# Altium schematic sheet solid_state_overdrive.SchDoc
size A4
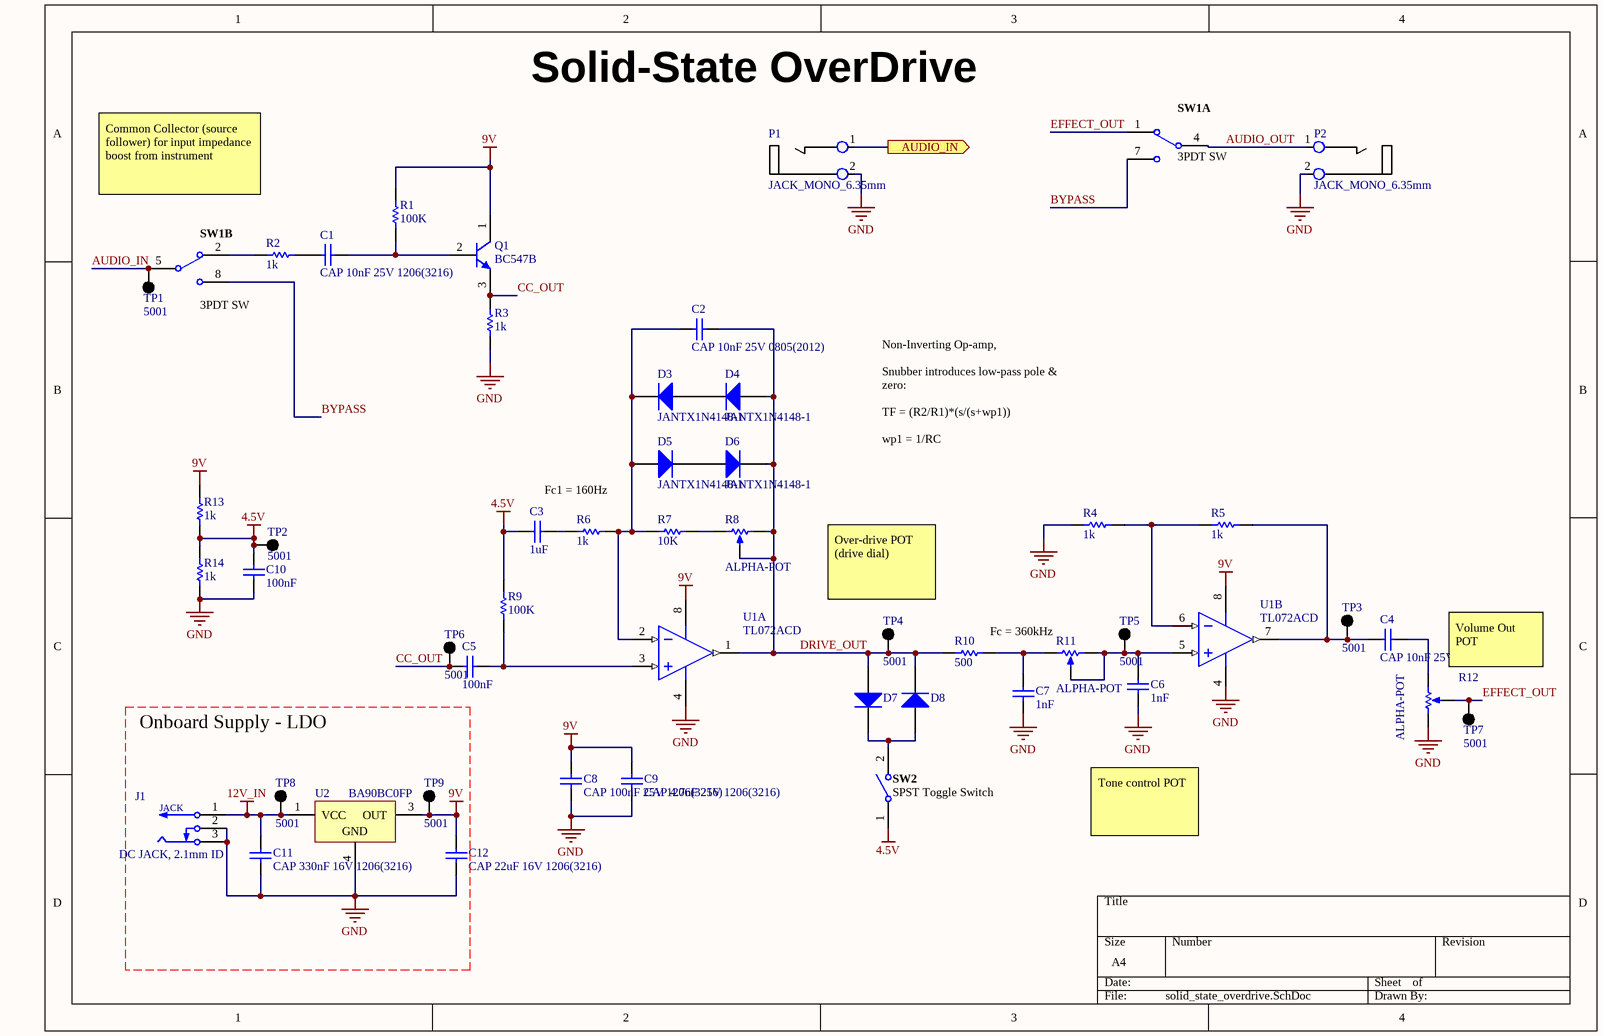
[diagram p0: solid_state_overdrive.SchDoc]

## Parts
C1  CAP 10nF 25V 1206(3216)  [CAPC1206(3216)170_N]
C2  CAP 10nF 25V 0805(2012)  [CAPC0805(2012)75_L]
C3  value 1uF  [CAPC0805(2012)145_L]  (hidden comment: CAP 1uF 50V 0805(2012))
C4  CAP 10nF 25V 1206(3216)  [CAPC1206(3216)170_N]
C5  value 100nF  [CAPC0805(2012)145_N]  (hidden comment: CAP 100nF 50V 0805(2012))
C6  value 1nF  [CAPC0805(2012)75_M]  (hidden comment: CAP 1nF 50V 0805(2012))
C7  value 1nF  [CAPC0805(2012)75_M]  (hidden comment: CAP 1nF 50V 0805(2012))
C8  CAP 100nF 25V 1206(3216)  [CAPC1206(3216)190_L]
C9  CAP 4.7nF 25V 1206(3216)  [CAPC1206(3216)100_N]
C10  value 100nF  [CAPC0805(2012)145_N]  (hidden comment: CAP 100nF 50V 0805(2012))
C11  CAP 330nF 16V 1206(3216)  [CAPC1206(3216)110_N]
C12  CAP 22uF 16V 1206(3216)  [CAPC1206(3216)190_M]
D3  JANTX1N4148-1  [MCSM-DO-35-2]
D4  JANTX1N4148-1  [MCSM-DO-35-2]
D5  JANTX1N4148-1  [MCSM-DO-35-2]
D6  JANTX1N4148-1  [MCSM-DO-35-2]
D7  JANTX1N4148-1  [MCSM-DO-35-2]  (value not drawn)
D8  JANTX1N4148-1  [MCSM-DO-35-2]  (value not drawn)
J1  DC JACK, 2.1mm ID  [163-179PH-EX]
P1  JACK_MONO_6.35mm  [MONO_JUMPER]
P2  JACK_MONO_6.35mm  [MONO_JUMPER]
Q1  BC547B  [ONSC-TO-92-3-29-11]
R1  value 100K  [RESC0805(2012)_L]  (hidden comment: 100K 5% 0805(2012))
R2  value 1k  [RESC0805(2012)_N]  (hidden comment: 1K 5% 0805(2012))
R3  value 1k  [RESC0805(2012)_N]  (hidden comment: 1K 5% 0805(2012))
R4  value 1k  [RESC0805(2012)_N]  (hidden comment: 1K 5% 0805(2012))
R5  value 1k  [RESC0805(2012)_N]  (hidden comment: 1K 5% 0805(2012))
R6  value 1k  [RESC0805(2012)_N]  (hidden comment: 1K 5% 0805(2012))
R7  value 10K  [RESC0805(2012)_L]  (hidden comment: 10K 5% 0805(2012))
R8  ALPHA-POT  [ALPHA_POT]
R9  value 100K  [RESC0805(2012)_L]  (hidden comment: 100K 5% 0805(2012))
R10  value 500  [RESC0805(2012)_L]  (hidden comment: 510R 5% 0805(2012))
R11  ALPHA-POT  [ALPHA_POT]
R12  ALPHA-POT  [ALPHA_POT]
R13  value 1k  [RESC0805(2012)_N]  (hidden comment: 1K 5% 0805(2012))
R14  value 1k  [RESC0805(2012)_N]  (hidden comment: 1K 5% 0805(2012))
SW1  3PDT SW  [3PDT]  (parts A,B of 3)
SW2  SPST Toggle Switch  [TOGGLE_SW_JUMPER]
TP1  5001  [KSTN-5001]
TP2  5001  [KSTN-5001]
TP3  5001  [KSTN-5001]
TP4  5001  [KSTN-5001]
TP5  5001  [KSTN-5001]
TP6  5001  [KSTN-5001]
TP7  5001  [KSTN-5001]
TP8  5001  [KSTN-5001]
TP9  5001  [KSTN-5001]
U1  TL072ACD  [D0008A_M]  (parts A,B of 2)
U2  BA90BC0FP  [BA90BC0FP-E2]

## Ports
AUDIO_IN (out)

## Nets
4.5V: C3.2 C10.2 R9.2 R13.2 R14.1 SW2.1 TP2.1
9V: C8.2 C9.2 C12.2 Q1.1(C) R1.2 R13.1 TP9.1 U1.8(VCC+) U2.3(OUT)
12V_IN: C11.2 J1.1 TP8.1 U2.1(VCC)
GND: C6.2 C7.2 C8.1 C9.1 C10.1 C11.1 C12.1 J1.2 J1.3 P1.2 P2.2 R3.1 R4.2 R12.3(CW) R14.2 U1.4(VCC-) U2.4(GND)
AUDIO_IN: P1.1 ; port AUDIO_IN
AUDIO_IN: SW1.5 TP1.1  [a separate net that carries the same name]
AUDIO_OUT: P2.1 SW1.4
BYPASS: SW1.7 SW1.8
CC_OUT: C5.1 Q1.3(E) R3.2 TP6.1
DRIVE_OUT: C2.2 D4.1(A) D6.2(K) D7.1(A) D8.2(K) R8.1(CCW) R8.2(WIPER) R10.2 TP4.1 U1.1(OUT1)
EFFECT_OUT: R12.2(WIPER) SW1.1 TP7.1
NetC1_1: C1.1 R2.1
NetC1_2: C1.2 Q1.2(B) R1.1
NetC2_1: C2.1 D3.2(K) D5.1(A) R6.1 R7.2 U1.2(IN1-)
NetC3_1: C3.1 R6.2
NetC4_1: C4.1 R5.1 TP3.1 U1.7(OUT2)
NetC4_2: C4.2 R12.1(CCW)
NetC5_2: C5.2 R9.1 U1.3(IN1+)
NetC6_1: C6.1 R11.1(CCW) R11.2(WIPER) TP5.1 U1.5(IN2+)
NetC7_1: C7.1 R10.1 R11.3(CW)
NetD3_1: D3.1(A) D4.2(K)
NetD5_2: D5.2(K) D6.1(A)
NetD7_2: D7.2(K) D8.1(A) SW2.2
NetR2_2: R2.2 SW1.2
NetR4_1: R4.1 R5.2 U1.6(IN2-)
NetR7_1: R7.1 R8.3(CW)

## Notes on the sheet
- Solid-State OverDrive
- Common Collector (source follower) for input impedance boost from instrument
- Non-Inverting Op-amp,
  Snubber introduces low-pass pole & zero:
  TF = (R2/R1)*(s/(s+wp1))
  wp1 = 1/RC
- Fc1 = 160Hz
- Over-drive POT (drive dial)
- Fc = 360kHz
- (near R12) Volume Out POT
- Onboard Supply - LDO
- Tone control POT
- Labels drawn without touching a wire or pin: GND
- (in symbol DC JACK, 2.1mm ID) JACK

## Library data of the parts
C1 C4 = CMP-1037-03495-1: CAP 10nF 25V ±20% 1206 (3216 Metric) Thickness 1.7mm SMD; Case-EIA: 1206; Case-Metric: 3216; Tolerance: Â±20%; Rated Voltage: 25 V; Max Thickness: 1.7 mm; Technology: SMT; Value: 10nF
C2 = CMP-1036-03833-1: CAP 10nF 25V ±20% 0805 (2012 Metric) Thickness 0.75mm SMD; Case-EIA: 0805; Tolerance: Â±20%; Case-Metric: 2012; Max Thickness: 0.75 mm; Technology: SMT; Value: 10nF; Rated Voltage: 25 V
C3 = CMP-1036-04761-1: CAP 1uF 50V ±10% 0805 (2012 Metric) Thickness 1.45mm SMD; Tolerance: Â±10%; Case-EIA: 0805; Case-Metric: 2012; Technology: SMT; Max Thickness: 1.45 mm; Rated Voltage: 50 V
C5 C10 = CMP-1036-04417-1: CAP 100nF 50V ±5% 0805 (2012 Metric) Thickness 1.45mm SMD; Case-Metric: 2012; Tolerance: Â±5%; Case-EIA: 0805; Max Thickness: 1.45 mm; Rated Voltage: 50 V; Technology: SMT
C6 C7 = CMP-1036-02981-1: CAP 1nF 50V ±20% 0805 (2012 Metric) Thickness 0.75mm SMD; Case-Metric: 2012; Case-EIA: 0805; Tolerance: Â±20%; Rated Voltage: 50 V; Technology: SMT; Max Thickness: 0.75 mm
C8 = CMP-1037-04186-1: CAP 100nF 25V ±1% 1206 (3216 Metric) Thickness 1.9mm SMD; Case-Metric: 3216; Tolerance: Â±1%; Case-EIA: 1206; Technology: SMT; Max Thickness: 1.9 mm; Rated Voltage: 25 V; Value: 100nF
C9 = CMP-1037-03099-1: CAP 4.7nF 25V ±1% 1206 (3216 Metric) Thickness 1mm SMD; Case-Metric: 3216; Case-EIA: 1206; Tolerance: Â±1%; Max Thickness: 1 mm; Value: 4.7nF; Technology: SMT; Rated Voltage: 25 V
C11 = CMP-1037-04467-1: CAP 330nF 16V ±20% 1206 (3216 Metric) Thickness 1.05mm SMD; Case-Metric: 3216; Case-EIA: 1206; Tolerance: Â±20%; Value: 330nF; Rated Voltage: 16 V; Max Thickness: 1.05 mm; Technology: SMT
C12 = CMP-1037-04993-1: CAP 22uF 16V ±20% 1206 (3216 Metric) Thickness 1.9mm SMD; Tolerance: Â±20%; Case-Metric: 3216; Case-EIA: 1206; Value: 22uF; Rated Voltage: 16 V; Technology: SMT; Max Thickness: 1.9 mm
D3-D8 = CMP-2000-06494-1: Glass Axial Switching Diode, 200 mA, 100 V, 2-Pin DO-35, RoHS, Bulk; Manufacturer: Microsemi; Peak Average Forward Current: 0.2A; Peak Reverse Recovery Time: 5ns; Rad Hard: No; Configuration: Single; Peak Forward Voltage: 1.2@0.1AV; Peak Reverse Repetitive Voltage: 75V; Breakdown Voltage: 100V; Peak Reverse Current: 0.5uA; Operating Temperature: -65to200°C; Package Description: 2-Pin Axial Lead, Dia 1.665 mm, Body Length 4.065 mm; PartNumber: 1N4148-1; Type: SwitchingDiode; Package: 2DO-35; Output Current: 0.2A; Mounting: ThroughHole; Mounting Technology: ThroughHole; Packaging: Bulk; Datasheet Version: Rev. 1, 11/2012; Manufacturer URL: http://www.microsemi.com/; Package Reference: DO-35-2; Datasheet URL: http://www.microsemi.com/document-portal/doc_download/125211-lds-0281
J1 = DC JACK, 2.1mm ID: DC BARREL JACK, 2.1mm ID; URL: https://ca.mouser.com/productdetail/163-179ph-ex
Q1 = CMP-1048-01467-1: Amplifier Transistor, NPN Silicon, 3-Pin TO-92, Bulk Box; Manufacturer: On Semiconductor; IC Continuous (A): 0.1; fT Min (MHz): 150; DatasheetVersion: Rev. 7; ComponentLink1URL: http://www.onsemi.com/; Polarity: NPN; RoHS: FALSE; ComponentLink1Description: Manufacturer URL; Packing: Bulk Box; PackageDescription: 3-Pin Transistor Outline, Body 4.825 x 3.685 mm, Pitch 1.27 mm; ComponentLink3URL: http://www.onsemi.cn/pub_link/Collateral/2N6426-D.PDF; ComponentLink2Description: Datasheet; PackageVersion: Rev. AM; PackageReference: TO-92-3-29-11_AM_SL; ComponentLink3Description: Package Specification; Mounting Technology: Through Hole; PartNumber: BC547B; ComponentLink2URL: http://www.onsemi.com/pub_link/Collateral/BC546-D.PDF
R1 R9 = CMP-1013-00122-1: 100K 0.125W 5% 0805 (2012 Metric)  SMD; Case-Metric: 2012; Case-EIA: 0805; Tolerance: 5 %; Technology: SMT; Power: 0.125 W
R2-R6 R13 R14 = CMP-1013-00074-1: 1K 0.125W 5% 0805 (2012 Metric)  SMD; Case-EIA: 0805; Case-Metric: 2012; Technology: SMT; Power: 0.125 W; Tolerance: 5 %
R7 = CMP-1013-00098-1: 10K 0.125W 5% 0805 (2012 Metric)  SMD; Case-EIA: 0805; Case-Metric: 2012; Power: 0.125 W; Technology: SMT; Tolerance: 5 %
R8 R11 R12 = ALPHA-POT: Manufacturer PN: RV09AF-40-20K-B50K; Manufacturer: Alpha; URL: http://www.taydaelectronics.com/potentiometer-variable-resistors/rotary-potentiometer/linear/b50k-ohm-linear-taper-potentiometer-round-knurled-plastic-shaft-pcb-9mm.html
R10 = CMP-1013-00067-1: 510R 0.125W 5% 0805 (2012 Metric)  SMD; Case-EIA: 0805; Case-Metric: 2012; Power: 0.125 W; Tolerance: 5 %; Technology: SMT
TP1-TP9 = CMP-2000-05181-1: Test Point, Black, 1-Pin THD, RoHS, Bulk; Manufacturer: Keystone; Other Names: 5001K; Catalog Drawings: 5000Series; Kits: DKTGRS232C-KIT-ND / -TTLCONVERTER; Online Catalog: ColorCodedTestPoints; Datasheet URL: https://ciiva.com/datasheet-click-2917627?src=ciiva&sig=bd195616; Family: TestPoints; RoHS Information: RoHSComplianceStatement; Datasheet Version: Rev. G, 12/2008; Color: Black; Category: TestandMeasurement; Standard Package: 100; Manufacturer URL: http://www.keyelco.com/; Material: Base,Nylon46,UL94V-0; Type: PCTestPoint,Miniature; Series: THM; Packaging: Bulk
U1 = CMP-0015-00092-2: Low-Noise JFET-Input Operational Amplifier, 7 to 36 V, 0 to 70 degC, 8-pin SOIC (D8), Green (RoHS & no Sb/Br); Manufacturer: Texas Instruments; Iq per channel(Max)(mA): 2.5; Total Supply Voltage(Max)(+5V is 5, +/-5V is 10): 36; Total Supply Voltage(Min)(+5V is 5, +/-5V is 10): 7; GBW(Typ)(MHz): 3; Sub Family: General Purpose Amplifier, High Supply Voltage Amplifier (>=30V); Number of Channels: 2; CMRR(Min)(dB): 75; Vn at 1kHz(Typ)(nV/rtHz): 18; Vio (25C)(Max)(mV): 6; Rating: Catalog; Slew Rate(Typ)(V/us): 13; IIB(Max)(pA): 200; PartNumber: TL072ACD; ComponentLink3Description: Package Specification; PackageDescription: 8-Pin Plastic Small Outline, Body 4.9 x 3.9 mm, Pitch 1.27 mm; ComponentLink1Description: Manufacturer URL; PackageVersion: 4040047-3/M, 06/2011; ComponentLink1URL: http://www.ti.com/; Code_JEDEC: MS-012; Mounting Technology: Surface Mount; ComponentLink3URL: http://www.ti.com/litv/pdf/msoi002j; ComponentLink2Description: Datasheet; Offset Drift(Typ)(uV/C): 18; PackageReference: D0008A; DatasheetVersion: SLOS080J; ComponentLink2URL: http://www.ti.com/lit/ds/symlink/tl072a.pdf; Eco-Plan: Green (RoHS & no Sb/Br); PartId: 1
U2 = BA90BC0FP: LDO Voltage Regulators REG 1A 9V; URL: https://ca.mouser.com/productdetail/755-ba90bc0fp-e2